# Altium schematic sheet Acquisition-System_Input_V1.0.SchDoc: Acquisition-System
size A4; PageSetup: Record=PageOptions|CenterHorizontal=True|CenterVertical=True|PrintScale=0.97|XCorrection=1.00|YCorrection=1.00|PrintKind=0|BorderSize=5000000|LeftOffset=0|BottomOffset=0|Orientation=2|PaperLength=1000|PaperWidth=1000|Scale=100|PaperSource=7|PrintQuality=-3|MediaType=1|DitherType=10|PrintScaleMode=1|PaperKind=A4|PaperIndex=9; Organization: Ostschweizer Fachhochschule; Address2: Florian Baumgartner & Thierry Schwaller; Address3: florian.baumgartner@ost.ch; DocumentNumber: 2; Revision: V1.0; SheetNumber: 2; SheetTotal: 5; Author: Florian Baumgartner & Alain Keller; Subtitle: PDM-Microphone Input
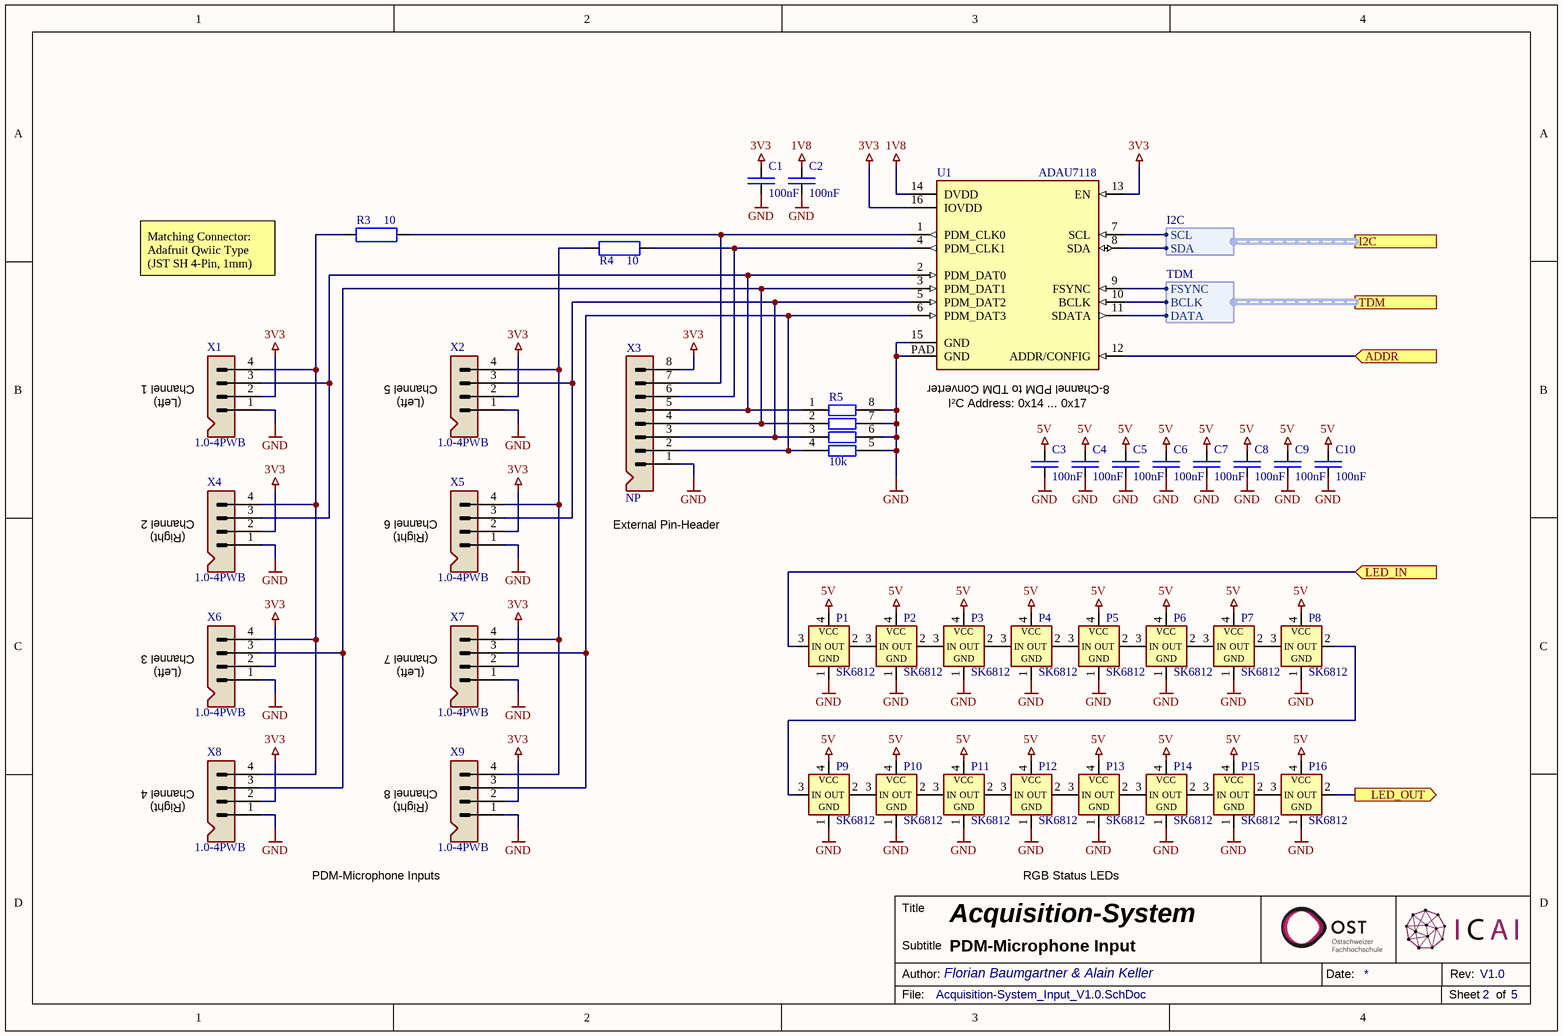
[diagram p0: Acquisition-System_Input_V1.0.SchDoc]

## Parts
C1  100nF  [SMD Keramikkondensator 0603]
C2  100nF  [SMD Keramikkondensator 0603]
C3  100nF  [SMD Keramikkondensator 0603]
C4  100nF  [SMD Keramikkondensator 0603]
C5  100nF  [SMD Keramikkondensator 0603]
C6  100nF  [SMD Keramikkondensator 0603]
C7  100nF  [SMD Keramikkondensator 0603]
C8  100nF  [SMD Keramikkondensator 0603]
C9  100nF  [SMD Keramikkondensator 0603]
C10  100nF  [SMD Keramikkondensator 0603]
P1  SK6812  [SMD LED WS2812B-3528]
P2  SK6812  [SMD LED WS2812B-3528]
P3  SK6812  [SMD LED WS2812B-3528]
P4  SK6812  [SMD LED WS2812B-3528]
P5  SK6812  [SMD LED WS2812B-3528]
P6  SK6812  [SMD LED WS2812B-3528]
P7  SK6812  [SMD LED WS2812B-3528]
P8  SK6812  [SMD LED WS2812B-3528]
P9  SK6812  [SMD LED WS2812B-3528]
P10  SK6812  [SMD LED WS2812B-3528]
P11  SK6812  [SMD LED WS2812B-3528]
P12  SK6812  [SMD LED WS2812B-3528]
P13  SK6812  [SMD LED WS2812B-3528]
P14  SK6812  [SMD LED WS2812B-3528]
P15  SK6812  [SMD LED WS2812B-3528]
P16  SK6812  [SMD LED WS2812B-3528]
R3  10  [SMD Widerstand 0603]
R4  10  [SMD Widerstand 0603]
R5  10k  [SMD Widerstand Array 4-Fach 0603]
U1  ADAU7118  [SMD IC TO-263-5]
X1  1.0-4PWB  [THT Pin-Header 4x1 (NP)]
X2  1.0-4PWB  [THT Pin-Header 4x1 (NP)]
X3  NP  [THT Pin-Header 1x6 (NP)]
X4  1.0-4PWB  [THT Pin-Header 4x1 (NP)]
X5  1.0-4PWB  [THT Pin-Header 4x1 (NP)]
X6  1.0-4PWB  [THT Pin-Header 4x1 (NP)]
X7  1.0-4PWB  [THT Pin-Header 4x1 (NP)]
X8  1.0-4PWB  [THT Pin-Header 4x1 (NP)]
X9  1.0-4PWB  [THT Pin-Header 4x1 (NP)]

## Ports
ADDR (in), I2C (harness I2C), LED_IN (in), LED_OUT (out), TDM (harness TDM)

## Harnesses
TDM: BCLK, FSYNC, DATA
I2C: SCL, SDA

## Nets
1V8: C2.2 U1.14(DVDD)
3V3: C1.2 U1.13(EN) U1.16(IOVDD) X1.2 X2.2 X3.8 X4.2 X5.2 X6.2 X7.2 X8.2 X9.2
5V: C3.2 C4.2 C5.2 C6.2 C7.2 C8.2 C9.2 C10.2 P1.4(VCC) P2.4(VCC) P3.4(VCC) P4.4(VCC) P5.4(VCC) P6.4(VCC) P7.4(VCC) P8.4(VCC) P9.4(VCC) P10.4(VCC) P11.4(VCC) P12.4(VCC) P13.4(VCC) P14.4(VCC) P15.4(VCC) P16.4(VCC)
GND: C1.1 C2.1 C3.1 C4.1 C5.1 C6.1 C7.1 C8.1 C9.1 C10.1 P1.1(GND) P2.1(GND) P3.1(GND) P4.1(GND) P5.1(GND) P6.1(GND) P7.1(GND) P8.1(GND) P9.1(GND) P10.1(GND) P11.1(GND) P12.1(GND) P13.1(GND) P14.1(GND) P15.1(GND) P16.1(GND) R5.5 R5.6 R5.7 R5.8 U1.15(GND) U1.PAD(GND) X1.1 X2.1 X3.1 X4.1 X5.1 X6.1 X7.1 X8.1 X9.1
ADDR: U1.12(ADDR/CONFIG) ; port ADDR
LED_IN: P1.3(IN) ; port LED_IN
LED_OUT: P16.2(OUT) ; port LED_OUT
NetP1_2: P1.2(OUT) P2.3(IN)
NetP2_2: P2.2(OUT) P3.3(IN)
NetP3_2: P3.2(OUT) P4.3(IN)
NetP4_2: P4.2(OUT) P5.3(IN)
NetP5_2: P5.2(OUT) P6.3(IN)
NetP6_2: P6.2(OUT) P7.3(IN)
NetP7_2: P7.2(OUT) P8.3(IN)
NetP8_2: P8.2(OUT) P9.3(IN)
NetP9_2: P9.2(OUT) P10.3(IN)
NetP10_2: P10.2(OUT) P11.3(IN)
NetP11_2: P11.2(OUT) P12.3(IN)
NetP12_2: P12.2(OUT) P13.3(IN)
NetP13_2: P13.2(OUT) P14.3(IN)
NetP14_2: P14.2(OUT) P15.3(IN)
NetP15_2: P15.2(OUT) P16.3(IN)
NetR3_1: R3.1 U1.1(PDM_CLK0) X3.7
NetR3_2: R3.2 X1.4 X4.4 X6.4 X8.4
NetR4_1: R4.1 U1.4(PDM_CLK1) X3.6
NetR4_2: R4.2 X2.4 X5.4 X7.4 X9.4
NetR5_1: R5.1 U1.2(PDM_DAT0) X1.3 X3.5 X4.3
NetR5_2: R5.2 U1.3(PDM_DAT1) X3.4 X6.3 X8.3
NetR5_3: R5.3 U1.5(PDM_DAT2) X2.3 X3.3 X5.3
NetR5_4: R5.4 U1.6(PDM_DAT3) X3.2 X7.3 X9.3
NetU1_7: U1.7(SCL) ; port I2C.SCL
NetU1_8: U1.8(SDA) ; port I2C.SDA
NetU1_9: U1.9(NC) ; port TDM.FSYNC
NetU1_10: U1.10(NC) ; port TDM.BCLK
NetU1_11: U1.11(NC) ; port TDM.DATA

## Notes on the sheet
- Matching Connector:
  Adafruit Qwiic Type
  (JST SH 4-Pin, 1mm)
- (near X1) Channel 1
- (near X2) Channel 5
- (near U1) 8-Channel PDM to TDM Converter
- (near X1) (Left)
- (near X2) (Left)
- I²C Address: 0x14 ... 0x17
- (near X4) Channel 2
- (near X5) Channel 6
- External Pin-Header
- (near X4) (Right)
- (near X5) (Right)
- (near X6) Channel 3
- (near X7) Channel 7
- (near X6) (Left)
- (near X7) (Left)
- (near X8) Channel 4
- (near X9) Channel 8
- (near X8) (Right)
- (near X9) (Right)
- PDM-Microphone Inputs
- RGB Status LEDs
- Title
- Author:
- Subtitle
- Date:
- Rev:
- File:
- Sheet
- of

## Library data of the parts
C1-C10 = E6 - 100nF: SMD Ceramic Capacitor E6; Component Value: 100nF 50V; Component Description: Multilayer Ceramic Capacitors MLCC; ComponentLink1Description: Datasheet; ComponentLink1URL: https://datasheet.lcsc.com/lcsc/1809301912_YAGEO-CC0603KRX7R9BB104_C14663.pdf; Digikey: 445-6899-1-ND; Farnell: 2210822; JLC-Parts: C14663; Mouser: 810-CGA2B3X7R1H104K; Unit Price: 0.01
P1-P16 = P-SK6812D-EC3210R: Smart RGB-LED; aliExpress: 1005003125851992; Digikey: 1528-4893-ND; Mouser: 485-4893; JLC-Parts: C2890041; ComponentLink1Description: Datasheet; ComponentLink1URL: https://datasheet.lcsc.com/lcsc/2108251530_OPSCO-Optoelectronics-SK6812D-EC3210R_C2890041.pdf; Component Description: Smart RGB-LED; Component Value: SK6812D-EC3210R; Unit Price: 0.12
R3 R4 = R-RESISTOR: RES (E=Heizwiderstand B=Messwandler); Component Description: Thick Film Chip Resistor; Component Value: 10 (75V, 100mW, 1%); Digikey: P10.0HCT-ND; Farnell: 2302958; Mouser: 667-ERJ-3EKF10R0V; JLC-Parts: C22859; Unit Price: 0.01
R5 = R-Array Single Quad E24 - 10k: Isolated Resistor Array; Component Value: 10k (4x, 50V, 62.5mW, 5%); ComponentLink1Description: Datasheet; ComponentLink1URL: https://datasheet.lcsc.com/lcsc/1810191515_UNI-ROYAL-Uniroyal-Elec-4D03WGJ0103T5E_C29718.pdf; Digikey: Y4103CT-ND; Farnell: 2060167; JLC-Parts: C29718; Mouser: 667-EXB-V8V103JV; Unit Price: 0.01; Component Description: Isolated Resistor Array
U1 = U-ADAU7118: 8-Channel PDM to I²S/TDM Converter; Component Value: ADAU7118ACPZRL; ComponentLink1Description: Datasheet; ComponentLink1URL: https://www.analog.com/media/en/technical-documentation/data-sheets/ADAU7118.pdf; Digikey: 505-ADAU7118ACPZRLCT-ND; Farnell: 4033291; JLC-Parts: C654437; Mouser: 584-ADAU7118ACPZRL; Unit Price: 6.20; Component Description: 8-Channel PDM to I²S/TDM Converter
X1 X2 X4-X9 = X-Stiftleiste (4-Fach): Wire To Board Connector (1x4P 1.0mm); Digikey: 455-SM04B-SRSS-TBCT-ND; Farnell: 1830839; Component Description: Wire To Board Connector (1x4P 1.0mm); Component Value: 1.0-4PWB; JLC-Parts: C2905006; Unit Price: 0.03
X3 = X-Stiftleiste (8-Fach): Component Description: Pin Header